# Altium schematic sheet EspProg.SchDoc: =ProjectTitle
size A4; CompanyName: Phenikaa Electronics; Organization: R&D; SheetNumber: 11; SheetTotal: 11
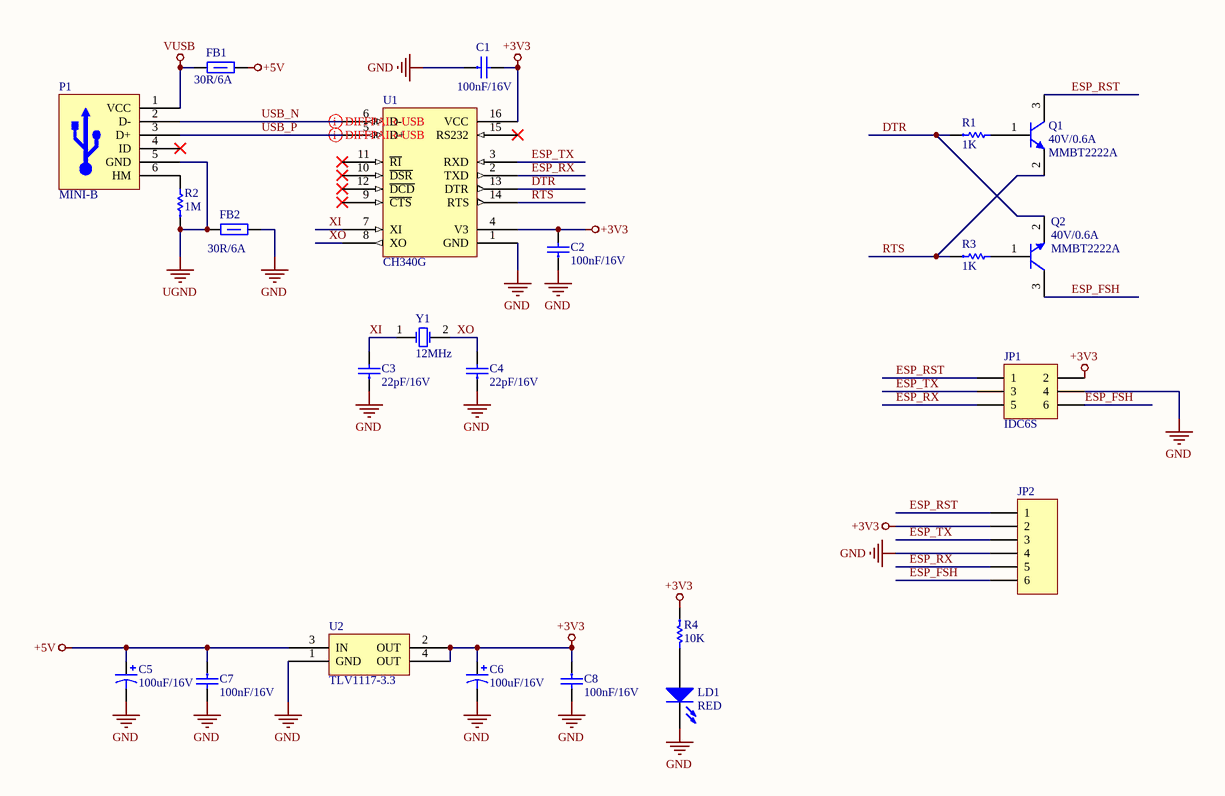
[diagram p0: EspProg.SchDoc]

## Parts
C1  100nF/16V  [CAP-CER0603-0.8H]
C2  100nF/16V  [CAP-CER0603-0.8H]
C3  22pF/16V  [CAP-CER0603-0.8H]
C4  22pF/16V  [CAP-CER0603-0.8H]
C5  100uF/16V  [CAP-ALU-6.3D5.8H-SMD]
C6  100uF/16V  [CAP-ALU-6.3D5.8H-SMD]
C7  100nF/16V  [CAP-CER0603-0.8H]
C8  100nF/16V  [CAP-CER0603-0.8H]
FB1  30R/6A  [IND-C0805-1.1H]
FB2  30R/6A  [IND-C0805-1.1H]
JP1  IDC6S  [CON-IDC6-2.54P9.3H-S-THR]
JP2  XH2.54M-1X06V-7H  [CON-XH2.54-6S]  (value not drawn)
LD1  RED  [LED-IND0603-RED-0.6H]
P1  MINI-B  [CON-USB-MINIB-SMD]
Q1  40V/0.6A  NOTE: MMBT2222A  [SOT23-3-1.1H]
Q2  40V/0.6A  NOTE: MMBT2222A  [SOT23-3-1.1H]
R1  1K  [RES-CHP0603-0.6H]
R2  1M  [RES-CHP0603-0.6H]
R3  1K  [RES-CHP0603-0.6H]
R4  10K  [RES-CHP0603-0.6H]
U1  CH340G  [SOIC16-1.75H]
U2  TLV1117-3.3  [SOT223-4N-1.8H]
Y1  12MHz  [XTAL-HC49S-4.1H-SMD]

## Nets
+3V3: C1.2 C2.2 C6.1 C8.1 JP1.2 JP2.2 R4.1 U1.4(V3) U1.16(VCC) U2.2(OUT) U2.4(OUT)
+5V: C5.1 C7.1 FB1.2 U2.3(IN)
GND: C1.1 C2.1 C3.1 C4.1 C5.2 C6.2 C7.2 C8.2 FB2.2 JP1.4 JP2.4 LD1.2(K) U1.1(GND) U2.1(GND)
UGND: FB2.1 P1.5(GND) R2.1
VUSB: FB1.1 P1.1(VCC)
DTR: Q2.2(E) R1.1 U1.13(DTR)
ESP_FSH: JP1.6 JP2.6 Q2.3(C)
ESP_RST: JP1.1 JP2.1 Q1.3(C)
ESP_RX: JP1.5 JP2.5 U1.2(TXD)
ESP_TX: JP1.3 JP2.3 U1.3(RXD)
RTS: Q1.2(E) R3.1 U1.14(RTS)
USB_N: P1.2(D-) U1.6(D-)
USB_P: P1.3(D+) U1.5(D+)
XI: C3.2 U1.7(XI) Y1.1(OSC1)
XO: C4.2 U1.8(XO) Y1.2(OSC2)
NetLD1_1: LD1.1(A) R4.2
NetP1_6: P1.6(HM) R2.2
NetQ1_1: Q1.1(B) R1.2
NetQ2_1: Q2.1(B) R3.2

Not connected (* = marked no-connect by the designer): P1 4(ID)*; U1 9(~{CTS})* 10(~{DSR})* 11(~{RI})* 12(~{DCD})* 15(RS232)*

## Layout directives
differential pair: USB_N, USB_P

## Notes on the sheet
- Title:
- Revision
- DrawnBy
- Engineer
- CheckedBy
- ApprovedBy
- Project:
- Model:
- Part Name:
- R&D
- Projection
- Unit:
- Scale:
- Size:
- Page:
- A4
- 1:1
- mm
- Part Code:
- Material:
- Q'ty:
- File:

## Library data of the parts
C1 C2 C7 C8 = CAPCER0008 0603 100nF/16V: CAP CER 100nF/16V 10% X7R 0603 SMD; MFR PN: CC0603KRX7R7BB104; MFR: YAGEO; LINE: SMT; TYPE: EP; UNIT: PCS; CERT: NA; CLASS: B; PRD CODE: (SAP); MOUNT: SMD; SRT PN: CAPCER0008
C3 C4 = CAPCER0060 0603 22pF/16V: CAP CER 22pF/16V 5% C0G 0603 SMD; MFR PN: C0603C220J4GAC7867; MFR: KEMET; LINE: SMT; TYPE: EP; UNIT: PCS; CLASS: B; CERT: NA; PRD CODE: (SAP); MOUNT: SMD; SRT PN: CAPCER0060
C5 C6 = CAPALU0012 6.3X5.8 100uF/16V SMD: CAP ALU 100uF/16V 20% 2K105 2.2P 6.3X5.8 SMD; MFR PN: UUD1C101MCL1GS; MFR: NICHICON; LINE: SMT; TYPE: EP; UNIT: PCS; CERT: NA; CLASS: B; PRD CODE: (SAP); MOUNT: SMD; SRT PN: CAPALU0012
FB1 FB2 = FILFER0001 0805 120R/3A: FIL FER CHP 1LN 120R 3A 0805 SMD; MFR PN: BLM21PG121SN1D; MFR: MURATA; LINE: SMT; TYPE: EP; UNIT: PCS; CLASS: B; NOTE: 120R@100MHz; CERT: NA; PRD CODE: (SAP); MOUNT: SMD; SRT PN: FILFER0001
JP1 = CONW2B0010 IDC2.54M-6PV: CON W2B IDC2.54M-2X3V-9H THR; MFR PN: BH254V-6P; MFR: XFCN; LINE: DIP; UNIT: PCS; CERT: NA; PRD CODE: (SAP); TYPE: EP; MOUNT: MI; CLASS: NA; NOTE: NA; SRT PN: CONW2B0010
JP2 = CONW2B0005 XH2.54M-1X06V-7H: CON B2B XH2.54M-1X06V-7H THR; MFR PN: WAFER-XH2.54-6PZZ; MFR: XUNPU; LINE: DIP; UNIT: PCS; CERT: NA; PRD CODE: (SAP); TYPE: EP; MOUNT: MI; CLASS: NA; NOTE: NA; SRT PN: CONW2B0005
LD1 = LEDIND0001 0603 RED: LED IND RED CLR 2V 20mA 0603 SMD; MFR PN: 150060SS75000; MFR: WURTH; TYPE: EP; UNIT: PCS; LINE: SMT; NOTE: 80mcd~220mcd, 130deg; CERT: NA; CLASS: B; PRD CODE: (SAP); MOUNT: SMD; SRT PN: LEDIND0001
P1 = CONUSB0000 USB2.0 MINI-B: CON USB V20 MBF1 SMD; MFR PN: NA; UNIT: PCS; LINE: SMT; CLASS: A; MOUNT: SMD; TYPE: EP; PHX PN: CONUSB0000; PHX CODE: NA; CERTIFICATION: NA
Q1 Q2 = BJTNPN0001 SOT23 40V/0.6A: BJT NPN 40V 0.6A SOT23-3 SMD; MFR PN: MMBT2222ALT1G; MFR: ONSEMI; CLASS: B; LINE: SMT; TYPE: EP; UNIT: PCS; CERT: NA; PRD CODE: (SAP); MOUNT: SMD; SRT PN: BJTNPN0001
R1 R3 = RESCHP0007 0603 1% 1K: RES CHP 1K 1% 1/10W 0603 SMD; MFR PN: RC0603FR-071KL; MFR: YAGEO; LINE: SMT; UNIT: PCS; CLASS: B; CERT: NA; PRD CODE: (SAP); MOUNT: SMD; TYPE: EP; SRT PN: RESCHP0007
R2 = RESCHP0036 0603 1% 1M: RES CHP 1M 1% 1/10W 0603 SMD; MFR PN: RC0603FR-071ML; MFR: YAGEO; LINE: SMT; UNIT: PCS; CLASS: B; CERT: NA; PRD CODE: (SAP); MOUNT: SMD; TYPE: EP; SRT PN: RESCHP0036
R4 = RESCHP0008 0603 1% 10K: RES CHP 10K 1% 1/10W 0603 SMD; MFR PN: RC0603FR-0710KL; MFR: YAGEO; LINE: SMT; UNIT: PCS; CERT: NA; CLASS: B; PRD CODE: (SAP); MOUNT: SMD; TYPE: EP; SRT PN: RESCHP0008
U1 = ICSINT0001 CH340G: ICS INT USB-TTL CH340G 16SOIC SMD; MFR PN: CH340C; MFR: WCH; CLASS: B; LINE: SMT; UNIT: PCS; CERT: NA; PRD CODE: (SAP); MOUNT: SMD; TYPE: EP; SRT PN: ICSINT0001
U2 = ICSVRE0001 SOT223 TLV1117-3.3: ICS VRE TLV1117-33 3V3 0.8A SOT223 SMD; MFR PN: TLV1117-33CDCYR; MFR: TI; LINE: SMT; UNIT: PCS; CERT: NA; CLASS: A; PRD CODE: (SAP); MOUNT: SMD; TYPE: EP; SRT PN: ICSVRE0001
Y1 = XTACRY0004 HC49S-SMD 12MHz: XTA CRY 12MHz 20pF 10PPM HC49S SMD; MFR PN: X49SM12MSB2SI; MFR: YXC; LINE: SMT; UNIT: PCS; CLASS: B; CERT: NA; PRD CODE: (SAP); TYPE: EP; MOUNT: SMD; SRT PN: XTACRY0004